# EAGLE design Design1 (EAGLE 8.3.2)
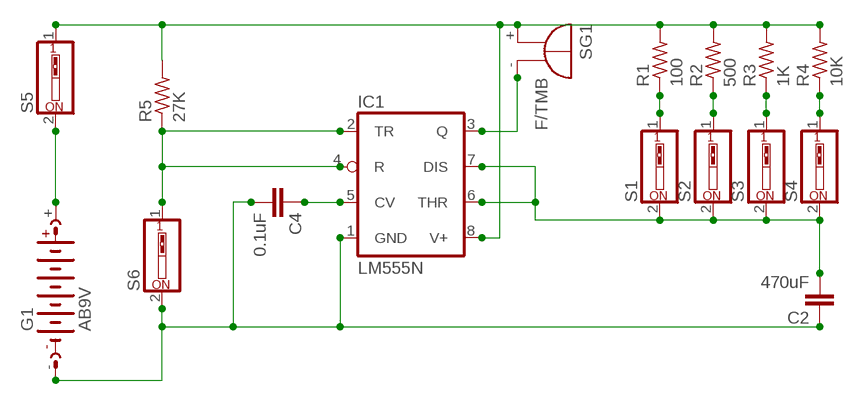
[diagram p0: schematic, sheet 1]

## Parts
C2  470uF  C5/2.5  [C5B2.5]
C4  0.1uF  C5/2.5  [C5B2.5]
G1  AB9V  [AB9V]
IC1  LM555N  [DIL08]
R1  100  R-US_0207/12  [0207/12]
R2  500  R-US_0207/12  [0207/12]
R3  1K  R-US_0207/12  [0207/12]
R4  10K  R-US_0207/12  [0207/12]
R5  27K  R-US_0207/12  [0207/12]
S1  SW_DIP-1  [EDG-01]
S2  SW_DIP-1  [EDG-01]
S3  SW_DIP-1  [EDG-01]
S4  SW_DIP-1  [EDG-01]
S5  SW_DIP-1  [EDG-01]
S6  SW_DIP-1  [EDG-01]
SG1  F/TMB  [F/TMB]

## Nets
N$1: IC1.8(V+) R1.2 R2.2 R3.2 R4.2 R5.2 S5.1 SG1.+
N$2: R1.1 S1.1
N$3: C2.2 IC1.6(THR) IC1.7(DIS) S1.2 S2.2 S3.2 S4.2
N$4: C4.1 IC1.5(CV)
N$5: R2.1 S2.1
N$6: R3.1 S3.1
N$7: IC1.2(TR) IC1.4(R) R5.1 S6.1
N$8: IC1.3(Q) SG1.-
N$9: R4.1 S4.1
N$10: G1.+ S5.2
N$11: C2.1 C4.2 G1.- IC1.1(GND) S6.2

## Library data of the parts
C2 C4 = capacitor-wima:C: CAPACITOR naming: grid - package width
G1 = battery:AB9V: 9-V BATTERY CLIP
IC1 = linear:*555: TIMER
R1-R4 = rcl:R-US_: RESISTOR, American symbol
R5 = resistor:R-US_: RESISTOR, American symbol
S1-S6 = special:SW_DIP-1: DIP SWITCH
SG1 = buzzer:F/TMB: BUZZER Source: Buerklin; OC_FARNELL: unknown; OC_NEWARK: unknown

## Board
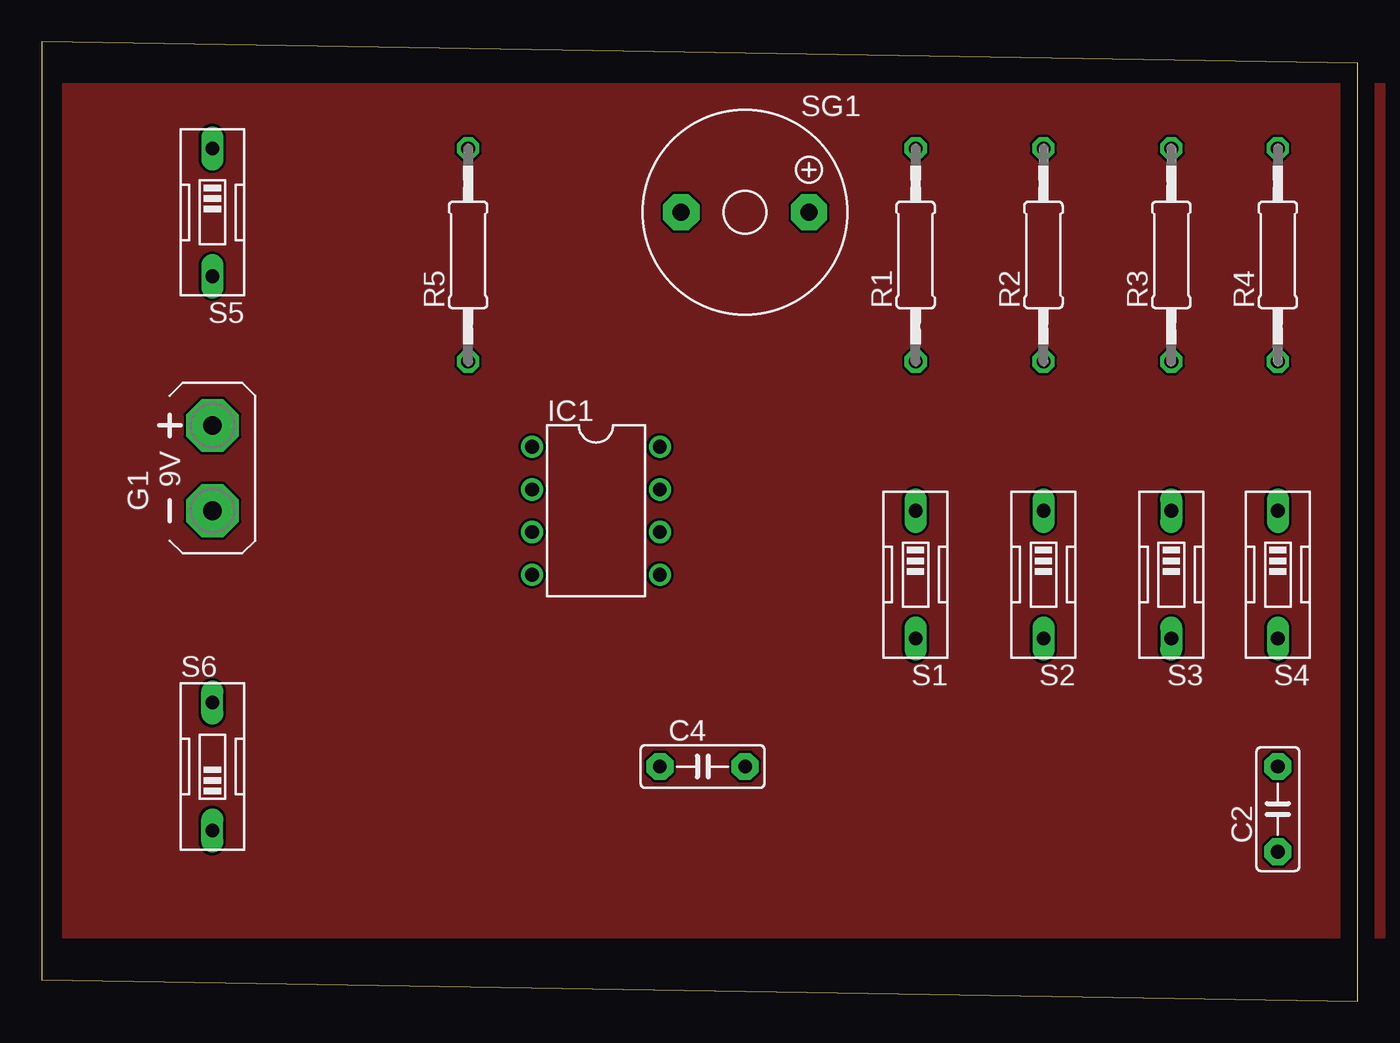
[diagram p1: board, top side]
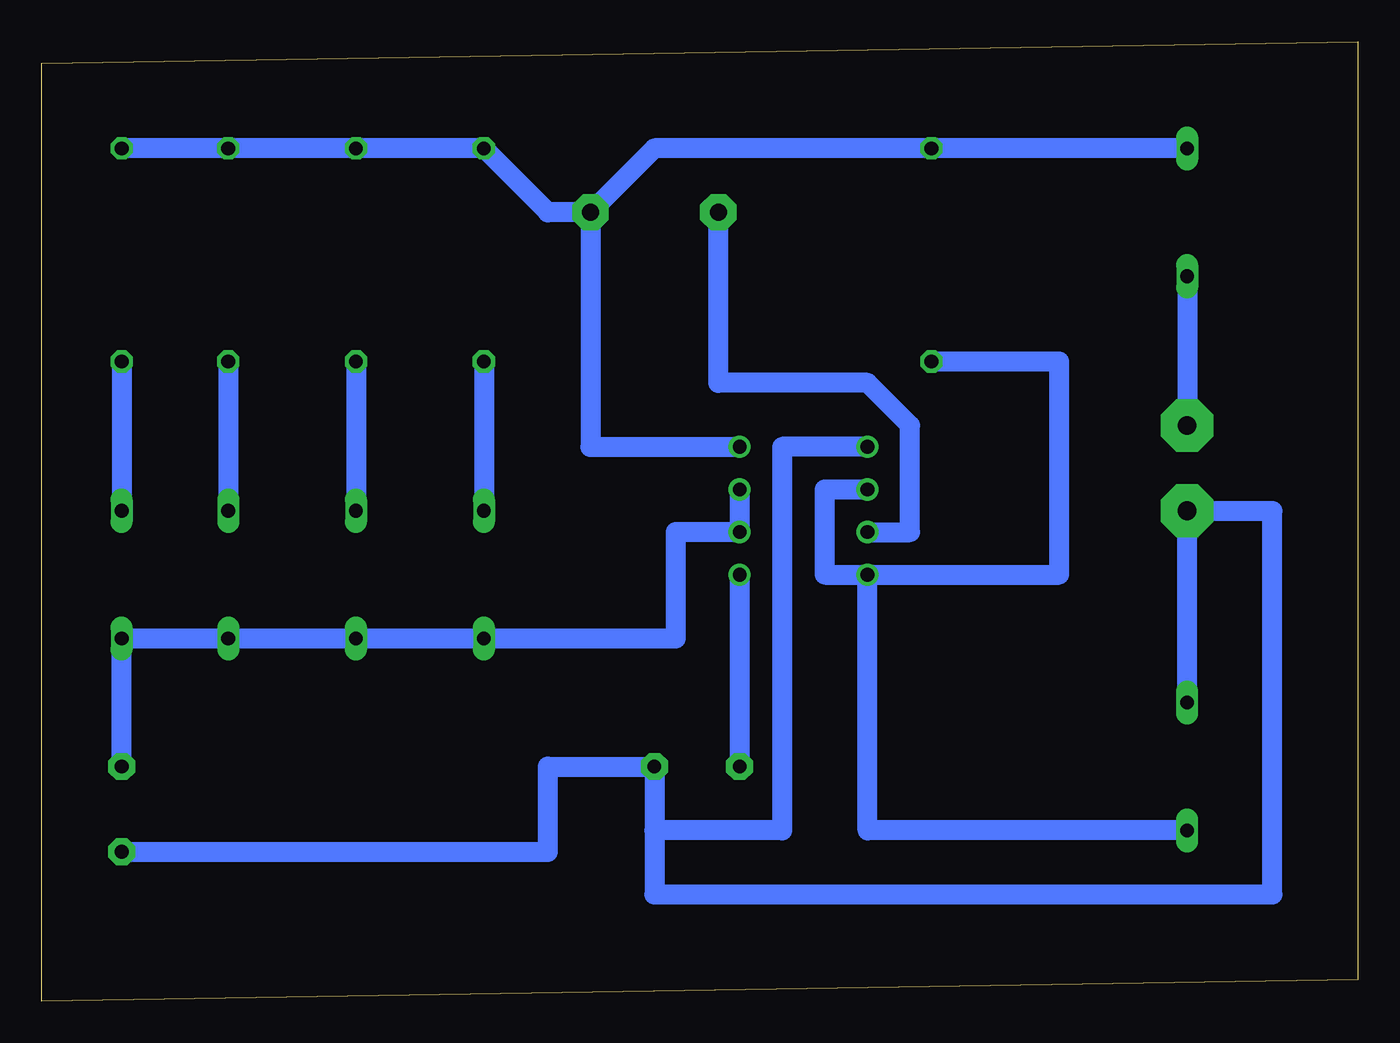
[diagram p2: board, bottom side, seen from below]

Size 78.41 x 57.14 mm. Coordinates in mm from the lower left corner, seen from the top.
Outline: 0,1.27 78.41,0 78.41,55.87 0,57.14 0,1.27
Copper layers (1*16): Top 0.035mm / dielectric 1.5mm / Bottom 0.035mm
Design rules "default": minimum track width 6mil, minimum drill 0.35mm, track to track 6mil, track to pad 6mil, pad to pad 6mil, via to via 6mil, smd to smd 6mil, copper to edge 40mil, drill to drill 6mil, minimum pad ring 10mil, minimum via ring 8mil, stop-mask expansion 4mil, vias tented up to drill 0mil, thermal gap 10mil

### Footprints (pad centres in the part's own frame; a part is rotated, then mirrored left to right if it is on the bottom)
C5B2.5 = drill 0.813 pad 1.6 octagon: 1 -2.54,0; 2 2.54,0
AB9V = drill 1.118 pad 3.15 octagon: + 0,2.54; - 0,-2.54
DIL08 = drill 0.813 pad 1.27: 1 -3.81,-3.81; 2 -1.27,-3.81; 3 1.27,-3.81; 4 3.81,-3.81; 5 3.81,3.81; 6 1.27,3.81; 7 -1.27,3.81; 8 -3.81,3.81
0207/12 = drill 0.813 octagon: 1 -6.35,0; 2 6.35,0
EDG-01 = drill 0.813 long: 1 0,-3.81; 2 0,3.81
F/TMB = drill 1.016 pad 2.159 octagon: + 3.81,0; - -3.81,0

### Placement (x,y rotation side)
C2  73.66,11.43 90 top
C4  39.37,13.97 0 top
G1  10.16,31.75 0 top
IC1  33.02,29.21 270 top
R1  52.07,44.45 90 top
R2  59.69,44.45 90 top
R3  67.31,44.45 90 top
R4  73.66,44.45 90 top
R5  25.4,44.45 90 top
S1  52.07,25.4 180 top
S2  59.69,25.4 180 top
S3  67.31,25.4 180 top
S4  73.66,25.4 180 top
S5  10.16,46.99 180 top
S6  10.16,13.97 0 top
SG1  41.91,46.99 0 top

### Tracks (layer width: path | path; a pad name or v marks a point on that pad's centre or on a via)
N$1
  Bottom 0.65: R1.2 R2.2 R3.2 R4.2
  Bottom 1: S5.1 R5.2 41.91,50.8
  Bottom 1.2: 41.91,50.8 R5.2 S5.1 41.91,50.8 | SG1.+ 41.91,50.8 | IC1.8 45.72,33.02 SG1.+ | SG1.+ 48.26,46.99 R1.2 R4.2 | 41.91,50.8 SG1.+
N$2
  Bottom 1.2: R1.1 S1.1
N$3
  Bottom 0.65: S4.2 S3.2 S2.2 S1.2 40.64,21.59
  Bottom 1.2: IC1.7 IC1.6 40.64,27.94 40.64,21.59 S4.2 C2.2
N$4
  Bottom 1.2: IC1.5 C4.1
N$5
  Bottom 1.2: R2.1 S2.1
N$6
  Bottom 1.2: R3.1 S3.1
N$7
  Bottom 0.65: 17.78,25.4 IC1.4 31.75,25.4
  Bottom 1: 31.75,25.4 IC1.4 17.78,25.4
  Bottom 1.2: S6.1 29.21,10.16 IC1.4 | IC1.2 31.75,30.48 31.75,25.4 17.78,25.4 17.78,38.1 R5.1
N$8
  Bottom 1.2: IC1.3 26.67,27.94 26.67,34.29 29.21,36.83 38.1,36.83 SG1.-
N$9
  Bottom 1.2: R4.1 S4.1
N$10
  Bottom 1.2: S5.2 G1.+
N$11
  Bottom 0.406: C4.2 41.91,10.16 41.91,6.35
  Bottom 1: C4.2 41.91,10.16 41.91,6.35
  Bottom 1.2: C2.1 48.26,8.89 48.26,13.97 C4.2 41.91,10.16 | 41.91,10.16 41.91,6.35 5.08,6.35 5.08,29.21 G1.- S6.2 | IC1.1 34.29,33.02 34.29,10.16 41.91,10.16
N$12
  pour Top: 1.27,54.61 80.01,54.61 80.01,3.81 3.81,3.81 2.54,3.81 1.27,3.81